# EAGLE design SiLabs2TC (EAGLE 7.4.0)
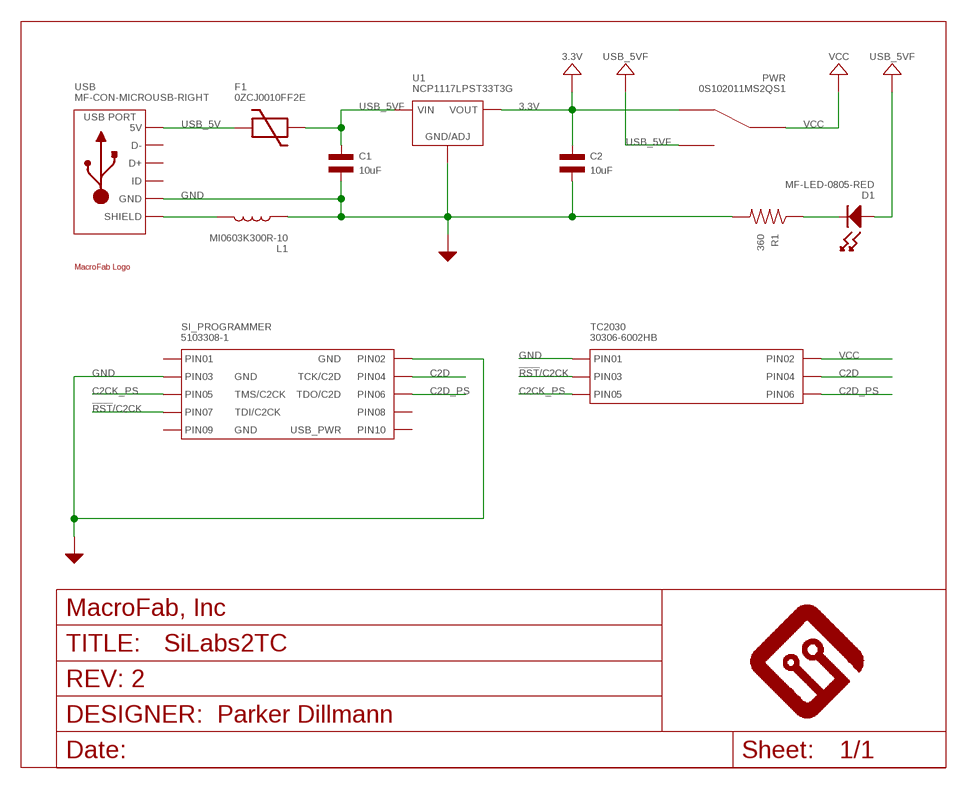
[diagram p0: schematic, sheet 1]

## Parts
C1  10uF  CAPACITOR_NP_1206  [C1206]
C2  10uF  CAPACITOR_NP_1206  [C1206]
D1  MF-LED-0805-RED  LED_SINGLE-0805-RED  [LED0805]
F1  0ZCJ0010FF2E  PTC_FUSE_1206  [1206]
FRAME1  MF_FRAMEDEFAULT  [MF_FRAME_DEFAULT]
L1  MI0603K300R-10  INDUCTOR_0603  [L0603]
PWR  0S102011MS2QS1  SPDT_0S102011MS2QS1  [0S102011MS2QS1]
R1  360  RESISTOR_0805  [R0805]
SI_PROGRAMMER  5103308-1  CON_02X05_5103308-1  [5103308-1]
TC2030  30306-6002HB  CON_02X03_30306-6002HB  [30306-6002HB]
U1  NCP1117LPST33T3G  [SOT-223-3]
U$3  MF_LOGOLOGO_MEDIUM  [MF_LOGO_MEDIUM]
USB  MF-CON-MICROUSB-RIGHT  USB_MICRO_RIGHT  [MICROUSB-RIGHT]

## Nets
3.3V: C2.P$1 PWR.1 U1.P$1(VOUT) U1.P$3(VOUT)
!RST!/C2CK: SI_PROGRAMMER.7(PIN7) TC2030.3(PIN3)
C2CK_PS: SI_PROGRAMMER.5(PIN5) TC2030.5(PIN5)
C2D: SI_PROGRAMMER.4(PIN4) TC2030.4(PIN4)
C2D_PS: SI_PROGRAMMER.6(PIN6) TC2030.6(PIN6)
GND: C1.P$2 C2.P$2 L1.P$1 R1.P$2 SI_PROGRAMMER.2(PIN2) SI_PROGRAMMER.3(PIN3) TC2030.1(PIN1) U1.P$2(GND/ADJ) USB.5(GND)
N$3: D1.CATHODE R1.P$1
N$4: L1.P$2 USB.S1(SLD) USB.S2(SLD) USB.S3(SLD) USB.S4(SLD) USB.S5(SLD) USB.S6(SLD)
USB_5V: F1.1 USB.1(5V)
USB_5VF: C1.P$1 D1.ANODE F1.2 PWR.3 U1.P$4(VIN)
VCC: PWR.2(C) TC2030.2(PIN2)
Unconnected: SI_PROGRAMMER.1(PIN1) SI_PROGRAMMER.8(PIN8) SI_PROGRAMMER.9(PIN9) SI_PROGRAMMER.10(PIN10) USB.2(D-) USB.3(D+) USB.4(ID)

## Library data of the parts
C1 C2 = MF_Passives:CAPACITOR_NP: Library: MF_Passives Description: Device for Non-Polarized Capacitors. Manufacture part number (MPN) can be added via Attributes. Check https://factory.macrofab.com/parts for the house parts list.; MPN: MF-CAP-1206-10uF; POPULATE: 1
D1 = MF_LEDs:LED_SINGLE: Library: MF_LEDs Description: Device for Single LED Packages. Manufacture part number (MFG#) can be added via Attributes.; HOUSEPART: YES; MPN: MF-LED-0805-RED; POPULATE: 1; URL: https://factory.macrofab.com/part/MF-LED-0805-RED
F1 = PP_Passives:PTC_FUSE; MPN: 0ZCJ0010FF2E; POPULATE: 1
FRAME1 = MF_Aesthetics:MF_FRAME: Library: MF_Aesthetics Description: Frame for adding Meta Data to the PCB and Schematic.; DNAME: Parker Dillmann; HOUSEPART: 0; POPULATE: 0; REVNUM: REV: 2
L1 = MF_Passives:INDUCTOR: Library: MF_Passives Description: Device for Inductors. Manufacture part number (MPN) can be added via Attributes. Check https://factory.macrofab.com/parts for the house parts list.; MPN: MI0603K300R-10; POPULATE: 1
PWR = PP_Electromechanical:SPDT; MPN: 0S102011MS2QS1; POPULATE: 1
R1 = MF_Passives:RESISTOR: Library: MF_Passives Description: Device for Resistors. Manufacture part number (MPN), Voltage, Tolerance, and Wattage Rating can be added via Attributes. Check https://factory.macrofab.com/parts for the house parts list.; MPN: MF-RES-0805-360; POPULATE: 1
SI_PROGRAMMER = PP_Connectors:CON_02X05; LABEL02: GND; LABEL03: GND; LABEL04: TCK/C2D; LABEL05: TMS/C2CK; LABEL06: TDO/C2D; LABEL07: TDI/C2CK; LABEL09: GND; LABEL10: USB_PWR; MPN: 5103308-1; POPULATE: 1
TC2030 = PP_Connectors:CON_02X03; MPN: 30306-6002HB; POPULATE: 1
U1 = MF_IC_Power:NCP1117LP: Manufacturer Part #: NCP1117LP Manufacturer: ON Semiconductor Description: LDO Voltage Regulators; HOUSEPART: NO; MPN: NCP1117LPST33T3G; POPULATE: 1; URL: http://www.onsemi.com/pub_link/Collateral/NCP1117LP-D.PDF
U$3 = PP_Aesthetics:MF_LOGO; POPULATE: 0
USB = MF_Connectors:USB: Library: MF_Connectors Description: 5 Pin USB Connectors. SLD is the shield connection. Usually tied to ground through a small ferrite bead.; HOUSEPART: YES; MPN: MF-CON-MICROUSB-RIGHT; POPULATE: 1; URL: https://factory.macrofab.com/part/MF-CON-MICROUSB-RIGHT

## Board
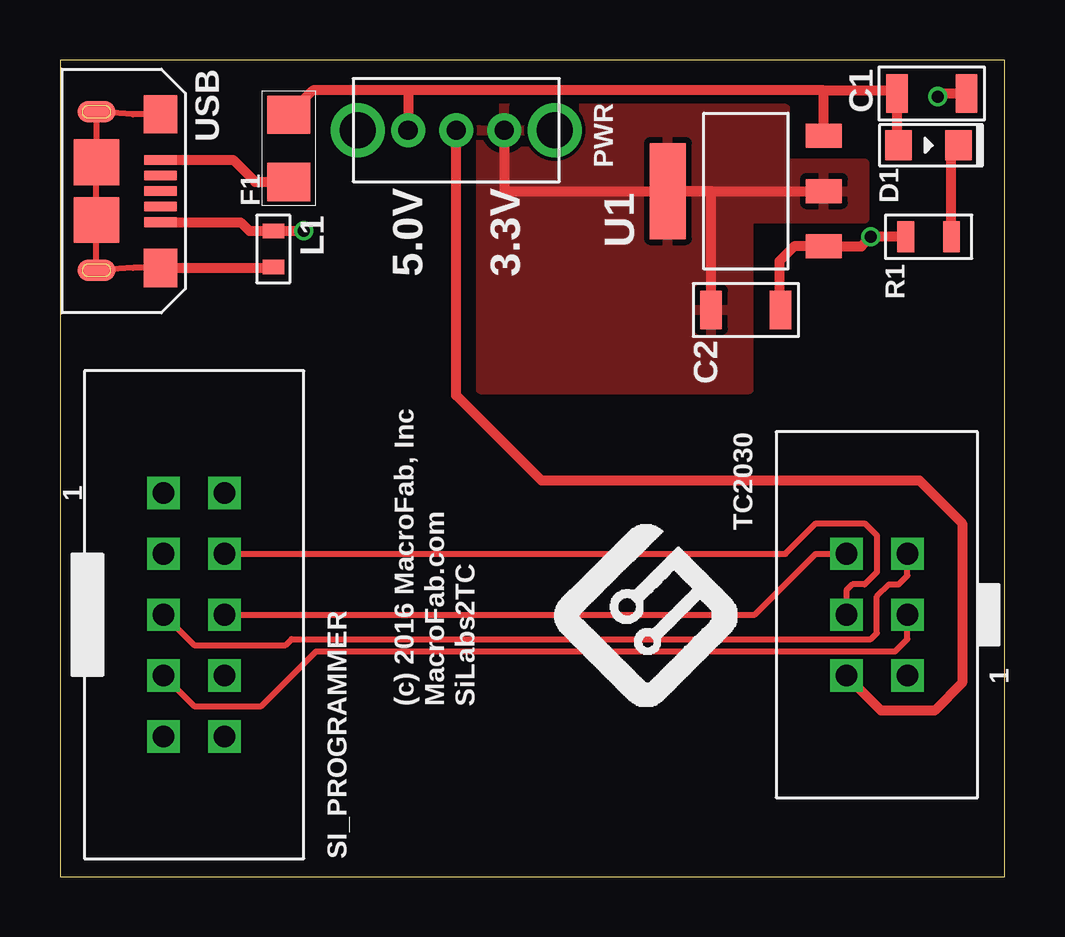
[diagram p1: board, top side]
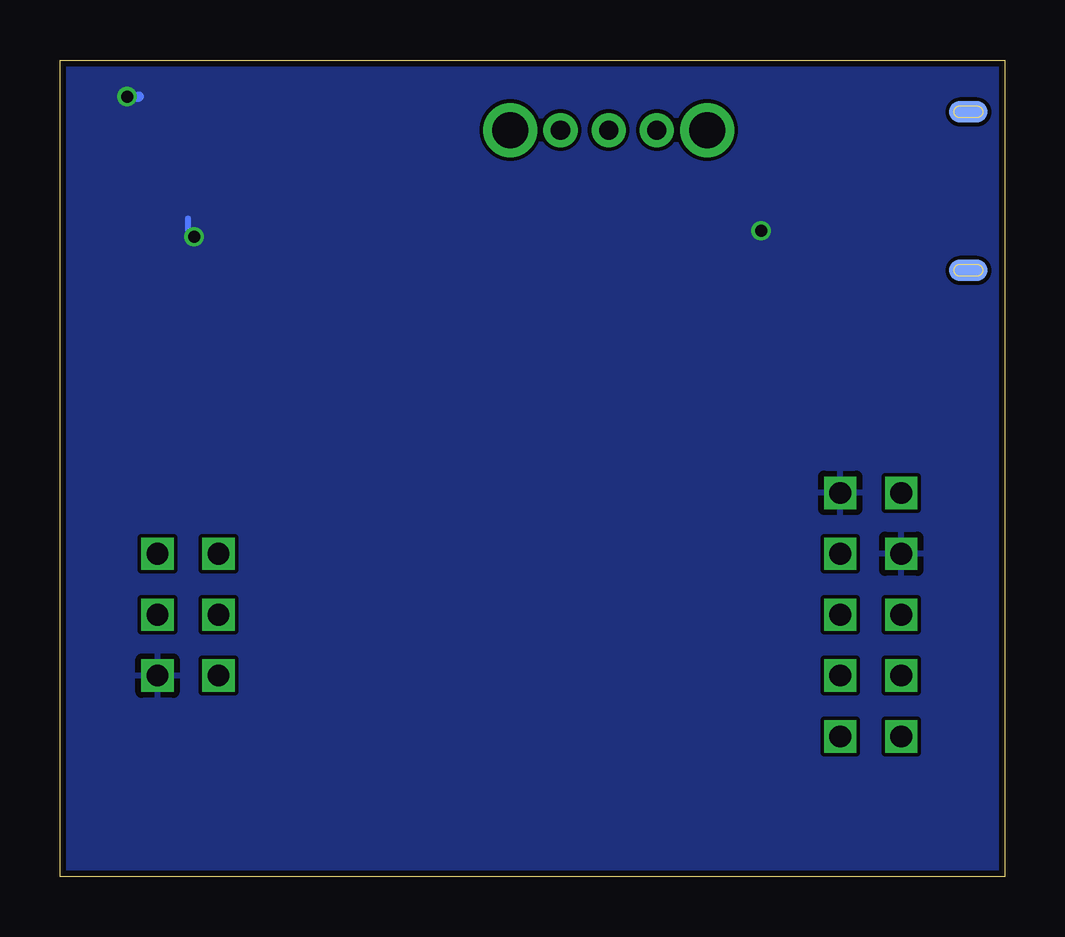
[diagram p2: board, bottom side, seen from below]

Size 39.37 x 34.04 mm. Coordinates in mm from the lower left corner, seen from the top.
Outline: 0,0 39.37,0 39.37,34.04 0,34.04 0,0
Copper layers (1*16): Top 0.035mm / dielectric 1.5mm / Bottom 0.035mm
Design rules "MF_Standard_2_Layer": minimum track width 6mil, minimum drill 12mil, track to track 6mil, track to pad 6mil, pad to pad 6mil, via to via 6mil, smd to smd 0mil, copper to edge 10mil, drill to drill 10mil, minimum pad ring 6mil, minimum via ring 6mil, stop-mask expansion 2mil, vias tented up to drill 25mil, thermal gap 10mil

### Footprints (pad centres in the part's own frame; a part is rotated, then mirrored left to right if it is on the bottom)
C1206 = smd 0.9 x 1.6: P$1 -1.45,0; P$2 1.45,0
LED0805 = smd 1.1 x 1.25: ANODE 1.25,0; CATHODE -1.25,0
1206 = smd 1.6 x 1.8: 1 -1.4,0; 2 1.4,0
L0603 = smd 0.6 x 0.9: P$1 -0.75,0; P$2 0.75,0
0S102011MS2QS1 = drill 0.8 pad 1.422: 1 -2.007,0; 2 0,0; 3 2.007,0 | drill 1.5 pad 2.184: P$4 -4.102,0; P$5 4.102,0
R0805 = smd 0.7 x 1.3: P$1 -0.95,0; P$2 0.95,0
5103308-1 = drill 0.9 square: 1 5.08,1.27; 2 5.08,-1.27; 3 2.54,1.27; 4 2.54,-1.27; 5 0,1.27; 6 0,-1.27; 7 -2.54,1.27; 8 -2.54,-1.27; 9 -5.08,1.27; 10 -5.08,-1.27
30306-6002HB = drill 0.9 square: 1 2.54,1.27; 2 2.54,-1.27; 3 0,1.27; 4 0,-1.27; 5 -2.54,1.27; 6 -2.54,-1.27
SOT-223-3 = smd 1.5 x 4: P$1 3.25,0 | smd 1.5 x 1: P$2 -3.25,2.3; P$3 -3.25,0; P$4 -3.25,-2.3
MICROUSB-RIGHT = smd 0.4 x 1.35: 1 -1.3,1.27; 2 -0.65,1.27; 3 0,1.27; 4 0.65,1.27; 5 1.3,1.27 | smd 0.9 x 1.6: S1 -3.3,-1.4; S2 3.3,-1.4 | smd 1.6 x 1.4: S3 -3.2,1.27; S4 3.2,1.27 | smd 1.9 x 1.9: S5 -1.2,-1.405; S6 1.2,-1.405 | smd 0.9 x 1.6 bottom: S7 -3.3,-1.4; S8 3.3,-1.4

### Placement (x,y rotation side)
C1  36.32,32.64 0 top
C2  28.57,23.62 0 top
D1  36.2,30.48 180 top
F1  9.53,30.35 90 top
FRAME1  13.46,7.11 90 top
L1  8.89,26.16 270 top
PWR  16.51,31.11 180 top
R1  36.2,26.67 180 top
SI_PROGRAMMER  5.59,10.92 90 top
TC2030  34.04,10.92 270 top
U1  28.57,28.57 180 top
U$3  28.19,7.11 90 top
USB  2.92,28.57 270 top

### Tracks (layer width: path | path; a pad name or v marks a point on that pad's centre or on a via)
3.3V
  Top 0.406: PWR.1 18.52,28.57 U1.P$1 | U1.P$1 U1.P$3 | C2.P$1 27.12,28.57 U1.P$1
  pour Top: 17.53,32 17.53,20.32 28.7,20.32 28.7,27.43 33.53,27.43 33.53,29.72 30.23,29.72 30.23,32
!RST!/C2CK
  Top 0.254: SI_PROGRAMMER.7 5.59,7.11 8.38,7.11 10.67,9.4 34.8,9.4 35.31,9.91 TC2030.3
C2CK_PS
  Top 0.254: SI_PROGRAMMER.5 5.59,9.65 9.4,9.65 9.65,9.91 33.78,9.91 34.04,10.16 34.04,11.68 34.54,12.19 34.95,12.19 35.31,12.55 TC2030.5
C2D
  Top 0.254: SI_PROGRAMMER.4 30.23,13.46 31.5,14.73 33.53,14.73 34.04,14.22 34.04,12.7 33.53,12.19 33.02,12.19 32.77,11.94 TC2030.4
C2D_PS
  Top 0.254: SI_PROGRAMMER.6 28.96,10.92 31.5,13.46 TC2030.6
GND  (via drill 0.5)
  Top 0.406: USB.5 7.52,27.27 7.89,26.91 L1.P$1 9.89,26.91 v10.16,26.92 | C2.P$2 29.97,23.62 29.97,25.65 30.59,26.27 U1.P$2 33.39,26.27 v33.78,26.67 R1.P$2 | C1.P$2 36.7,32.64 v36.58,32.51
  Bottom 0.254: v33.78,26.67 34.04,26.92 34.04,27.43
  Bottom 0.406: v36.58,32.51 36.07,32.51
  pour Bottom: 0,34.04 39.37,34.04 39.37,0 0,0
N$3
  Top 0.406: R1.P$1 37.15,30.48 D1.CATHODE
N$4
  Top 0.254: USB.S4 3.04,25.38 USB.S2 1.52,25.53 USB.S6 USB.S5 USB.S1 3.04,31.77 USB.S3
  Top 0.406: USB.S4 8.85,25.38 L1.P$2
USB_5V
  Top 0.406: USB.1 7.21,29.88 8.13,28.95 F1.1
USB_5VF
  Top 0.406: F1.2 10.54,32.77 14.5,32.77 | 14.5,32.77 PWR.3 | U1.P$4 31.82,32.77 | 31.82,32.77 14.5,32.77 | 31.82,32.77 34.74,32.77 arc-90 C1.P$1 34.87,30.55 arc90 D1.ANODE
VCC
  Top 0.406: TC2030.2 34.22,6.93 36.44,6.93 37.59,8.08 37.59,14.73 35.81,16.51 20.07,16.51 16.51,20.07 PWR.2

### Text on the board
tPlace: 5.0V | 3.3V